# EasyEDA Pro project CogletESP_2026-02-24.epro, board Adafruit MAX98357 Breakout
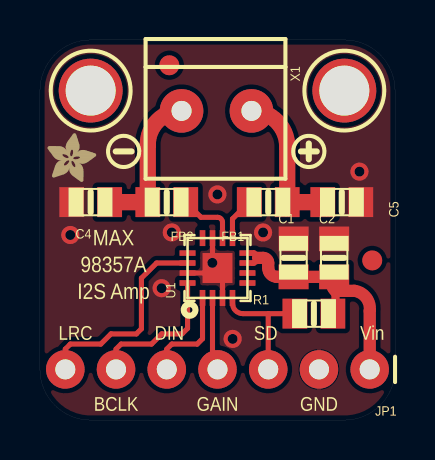
[diagram p9: board, top side]
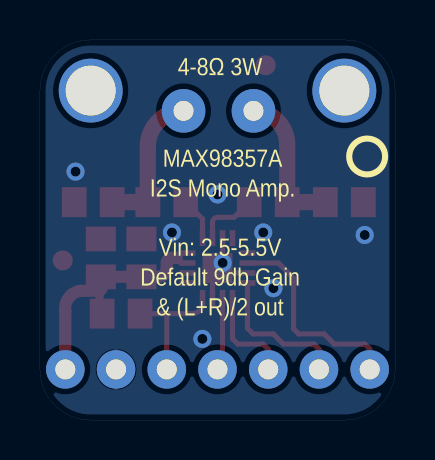
[diagram p10: board, bottom side, seen from below]

Outline 17.78 x 19.05 mm; copper layers: Top Layer, Bottom Layer. Coordinates in mm from the lower left corner of the outline.
Outline path: 0,16.51 arc(0.74,18.31) 2.54,19.05 15.24,19.05 arc(17.04,18.31) 17.78,16.51 17.78,2.54 arc(17.04,0.74) 15.24,0 2.54,0 arc(0.74,0.74) 0,2.54 0,16.51
Stack: Top Layer 0.035mm / Dielectric1 1.51mm FR4 er 4.5 / Bottom Layer 0.035mm

## Design rules (mm)
spacing safeClearance (default): track to track 0.203, other pairs 0 to 0.254
track width trackWidth: min 0.203, default 0.203, max 2.54
track width default (default): min 0.003, default 0.003, max 2.54
differential pair differentialPair (default): width min 0.127, default 0.254, max 2.54; gap min 0.152, default 0.152
via viaSize: diameter min 0.394, default 0.394, max 2.6; hole min 0.394, default 0.394, max 2
via default (default): diameter min 0, default 0, max 2.6; hole min 0, default 0, max 2
net GND uses CopperRegion1
pour ie1 uses CopperRegion
pour ie2 uses CopperRegion1

## Placement (name value [footprint] x y rotation side)
C1  0.1uF  [0805-NO]  12.7 8.13 90 top
C2  10uF  [0805-NO]  14.73 8.13 90 top
C4  220pF  [0805-NO]  2.54 10.92 180 top
C5  220pF  [0805-NO]  15.11 10.92 0 top
FB1  Ferrite  [0805-NO]  11.43 10.92 0 top
FB2  Ferrite  [0805-NO]  6.35 10.92 180 top
FID1  FIDUCIAL""  [FIDUCIAL_1MM]  16.64 8 0 top
FID2  FIDUCIAL""  [FIDUCIAL_1MM]  6.48 17.78 0 top
JP1  -  [1X07_ROUND_76]  8.89 2.54 180 top
R1  1M  [0805-NO]  13.72 5.33 0 top
U1  MAX98357A  [QFN16_3MM]  8.89 7.62 90 top
U$6  -  [SYMBOL_PLUS]  13.46 13.46 0 top
U$9  MOUNTINGHOLE2.5  [MOUNTINGHOLE_2.5_PLATED]  15.24 16.51 0 top
U$10  MOUNTINGHOLE2.5  [MOUNTINGHOLE_2.5_PLATED]  2.54 16.51 0 top
U$11  -  [SYMBOL_MINUS]  4.19 13.46 180 top
U$14  -  [ADAFRUIT_2.5MM]  0.38 11.94 0 top
U$15  -  [PCBFEAT-REV-040]  1.4 13.21 180 bottom
X1  -  [TERMBLOCK_1X2-3.5MM]  8.89 15.49 180 top

## Footprints (pads in the part's own frame, mm; a bottom-side part is the same pattern mirrored in y, then rotated)
1X07_ROUND_76
  round 1.931 hole 1: 1(-7.62,0) 2(-5.08,0) 3(-2.54,0) 4(0,0) 5(2.54,0) 6(5.08,0) 7(7.62,0)
0805-NO
  rect 1.24x1.5 smd: 1(-0.95,0) 2(0.95,0)
FIDUCIAL_1MM
  round 1 smd: 1(0,0)
MOUNTINGHOLE_2.5_PLATED
  round 3.2 hole 2.5: P$1(0,0)
QFN16_3MM
  rect 0.8x0.28 smd: 1(-1.5,0.75) 2(-1.5,0.25) 3(-1.5,-0.25) 4(-1.5,-0.75) 9(1.5,-0.75) 10(1.5,-0.25) 11(1.5,0.25) 12(1.5,0.75)
  rect 0.28x0.8 smd: 5(-0.75,-1.5) 6(-0.25,-1.5) 7(0.25,-1.5) 8(0.75,-1.5) 13(0.75,1.5) 14(0.25,1.5) 15(-0.25,1.5) 16(-0.75,1.5)
  rect 1.5x1.5 smd: THERMAL(0,0)
TERMBLOCK_1X2-3.5MM
  round 2.184 hole 1: 1(1.8,0) 2(-1.7,0)

## Nets
GND: C1.2 C2.2 C4.2 C5.2 JP1.2 U1.3 U1.11 U1.15 U1.THERMAL
VDD: C1.1 C2.1 JP1.1 R1.2 U1.7 U1.8
BCLK: JP1.6 U1.16
DIN: JP1.5 U1.1
GAIN: JP1.4 U1.2
LRCLK: JP1.7 U1.14
N$5: FB2.1 U1.10
N$6: FB1.1 U1.9
SD_MODE: JP1.3 R1.1 U1.4
VO+: C5.1 FB1.2 X1.2
VO-: C4.1 FB2.2 X1.1

Pads without a net: FID1 1; FID2 1; U1 5 6 12 13; U$9 P$1; U$10 P$1

## Via types
v1: diameter 0.906, hole 0.5, Top Layer to Bottom Layer, 8 vias

## Routing (per net, layer and track width the routed paths; a pad name or vN(x,y) marks a point on that pad's centre or on a via; arc(x,y) is an arc through that point)
GND: length 4.9
  Top Layer w0.254: U1.11 8.64,7.87 arc(8.71,7.69) U1.THERMAL ; U1.3 9.14,7.37 arc(9.07,7.55) U1.THERMAL ; U1.15 8.64,7.37 arc(8.82,7.44) U1.THERMAL
  vias: v1(1.52,9.28) v1(6.09,6.61) v1(6.6,9.4) v1(8.63,7.88) v1(8.89,11.31) v1(9.65,4.07) v1(11.17,9.4) v1(16,12.45)
VDD: length 13.8
  Top Layer w0.254: U1.7 10.66,7.87 arc(10.85,7.95) 10.92,8.13 arc(10.85,8.3) 10.68,8.37 U1.8
  Top Layer w0.406: 14.8,6.48 14.8,4.96 arc(14.65,5.12) R1.2
  Top Layer w0.61: JP1.1 16.51,5.46 arc(16.34,6.13) 15.75,6.48 14.8,6.48 arc(14.62,6.81) C2.1 C1.1 11.87,7.18 arc(11.56,7.31) 11.43,7.62 11.43,7.87 arc(11.36,8.05) 11.18,8.13 10.92,8.13
BCLK: length 7.3
  Top Layer w0.254: U1.16 7.39,4.6 7.11,4.32 6.1,4.32 5.59,3.81 4.06,3.81 3.81,3.56 JP1.6
DIN: length 5.1
  Top Layer w0.254: JP1.5 6.35,3.56 6.6,3.81 7.87,3.81 8.14,4.08 U1.1
GAIN: length 3.7
  Top Layer w0.254: U1.2 8.64,2.79 arc(8.71,2.61) JP1.4
LRCLK: length 10.4
  Top Layer w0.254: U1.14 5.84,7.87 5.08,7.11 5.08,4.57 4.83,4.32 3.56,4.32 3.05,3.81 1.52,3.81 1.27,3.56 JP1.7
N$5: length 3.1
  Top Layer w0.254: U1.10 9.14,9.91 arc(9.07,10.09) 8.89,10.16 8.06,10.16 FB2.1
N$6: length 2.1
  Top Layer w0.254: FB1.1 9.64,10.08 U1.9
SD_MODE: length 6.5
  Top Layer w0.254: JP1.3 11.43,5.33 ; 11.43,5.33 10.16,5.33 arc(9.79,5.49) 9.64,5.85 U1.4 ; 11.43,5.33 R1.1
VO+: length 7.4
  Top Layer w0.813: C5.1 FB1.2 12.38,13.7 arc(11.86,14.97) X1.2
VO-: length 7.4
  Top Layer w0.813: C4.1 FB2.2 5.4,13.8 arc(5.89,15) X1.1

## Copper pours and planes (outline as drawn; the poured copper is in the pictures)
GND on Top Layer: 17.78,19.05 17.78,0 0,0 0,19.05
GND on Bottom Layer: 17.78,19.05 17.78,0 0,0 0,19.05

## Text on the board
Bottom Silkscreen Layer: MAX98357A / I2S Mono Amp. | 4-8Ω 3W | Vin: 2.5-5.5V / Default 9db Gain / & (L+R)/2 out
Top Silkscreen Layer: LRC | BCLK | DIN | GAIN | SD | GND | Vin | MAX / 98357A / I2S Amp
